# EAGLE design test nano (EAGLE 7.1.0)
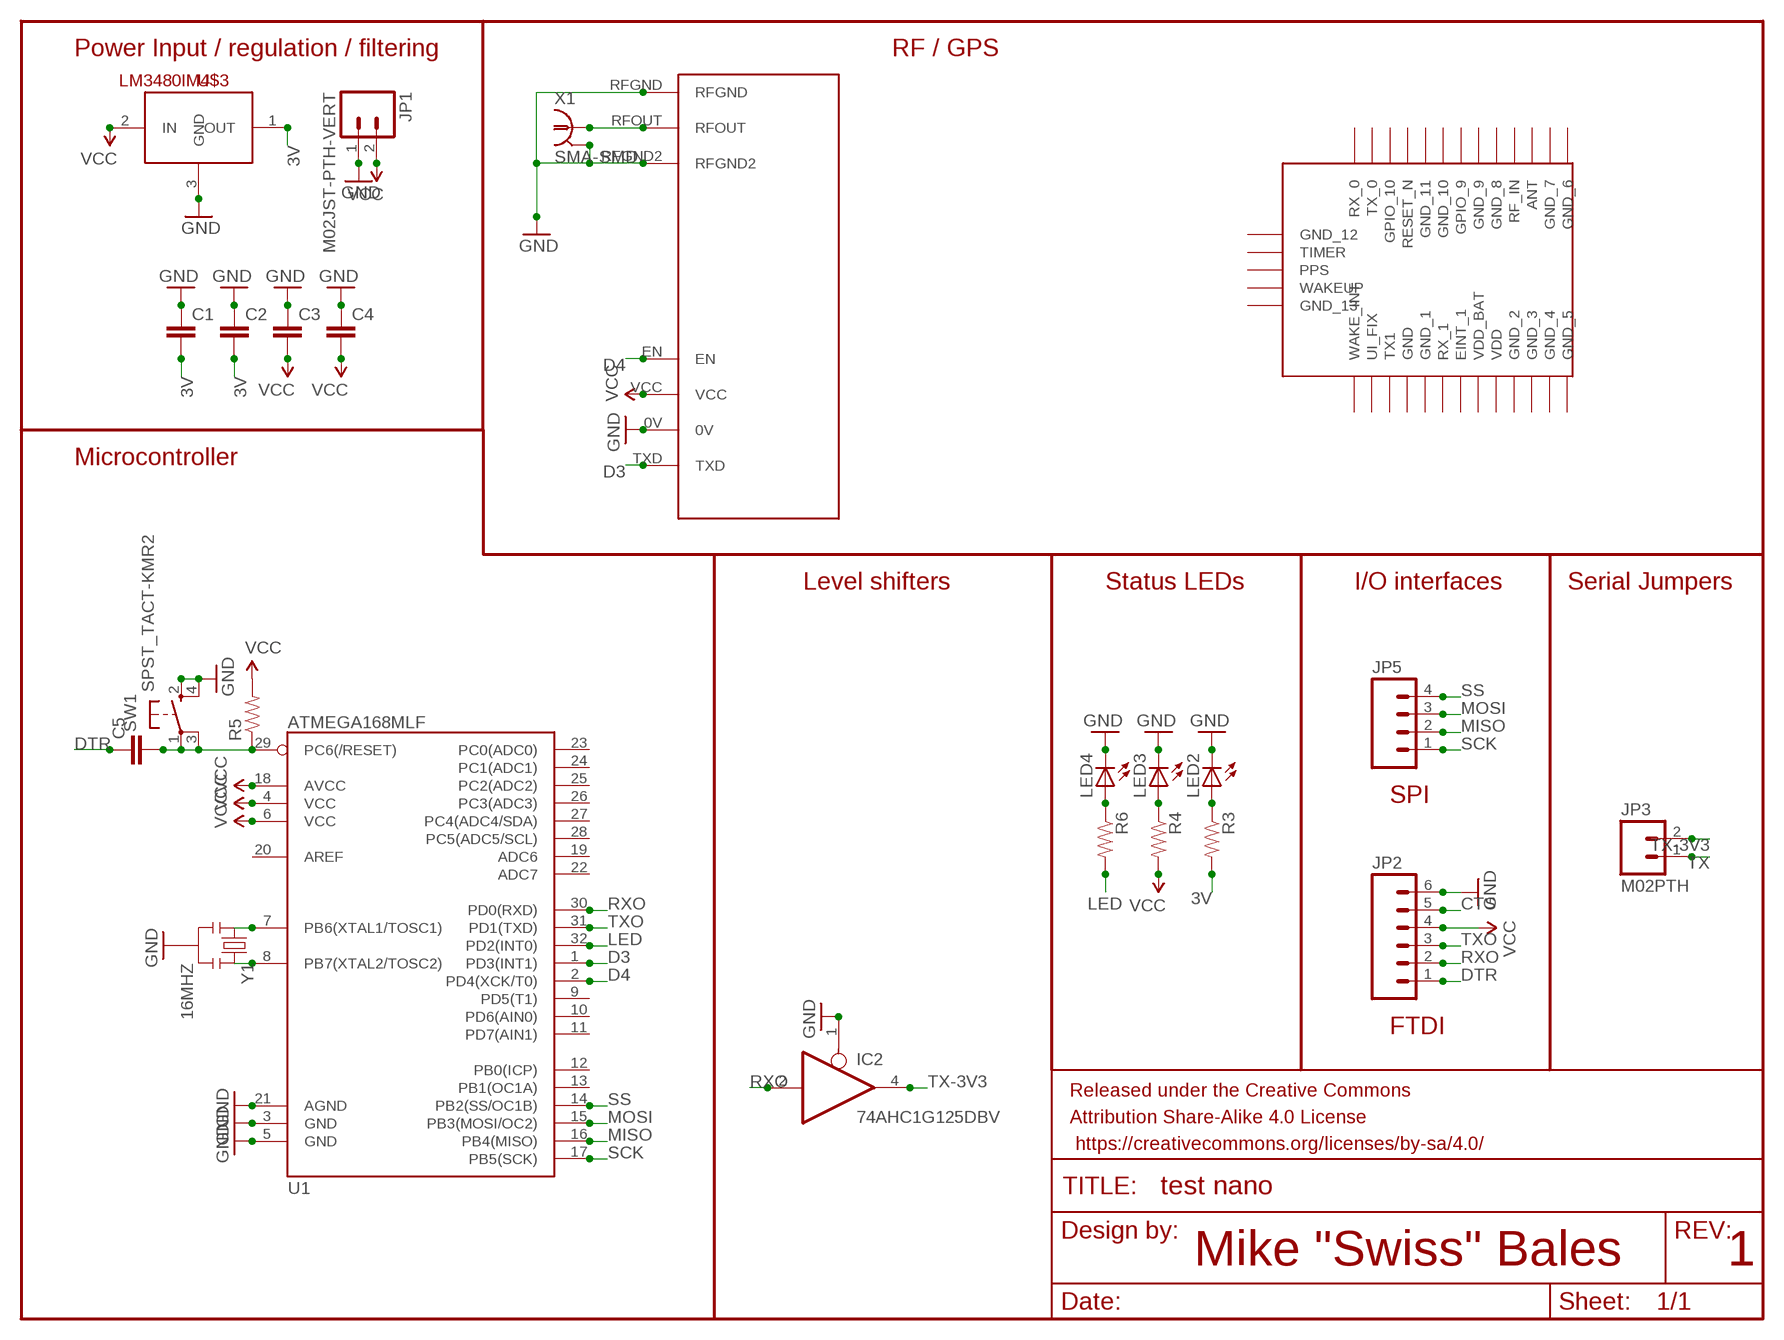
[diagram p0: schematic, sheet 1]

## Parts
C1  CAP0805  [0805]
C2  CAP0805  [0805]
C3  CAP0805  [0805]
C4  CAP0805  [0805]
C5  CAP0805  [0805]
FRAME1  FRAME-LETTER  [CREATIVE_COMMONS]
IC2  74AHC1G125DBV  [SOT23-5]
JP1  M02JST-PTH-VERT  [JST-2-PTH-VERT]
JP2  M06NO_SILK_FEMALE_PTH  [1X06_NO_SILK]
JP3  M02PTH  [1X02]
JP5  M041X04_NO_SILK  [1X04_NO_SILK]
LED2  LEDCHIP-LED0805  [CHIP-LED0805]
LED3  LEDCHIP-LED0805  [CHIP-LED0805]
LED4  LEDCHIP-LED0805  [CHIP-LED0805]
R3  RESISTOR0805-RES  [0805]
R4  RESISTOR0805-RES  [0805]
R5  RESISTOR0805-RES  [0805]
R6  RESISTOR0805-RES  [0805]
SW1  SPST_TACT-KMR2  [KMR2]
U1  ATMEGA168MLF  [MLF32]
U$1  UBLOXUC530  [UBLOXUC530]
U$2  RADIOMETRIX-HX1  [RADIOMETRIX-HX1]
U$3  LM3480IM4  [SOT23-3]
X1  SMA-SMD  [SMA-SMD]
Y1  16MHZ  RESONATOR16MHZ  [RESONATOR-SMD]

## Nets
3V: C1.2 C2.2 R3.2 U$3.1(OUT)
CTS: JP2.5
D3: U1.1(PD3(INT1)) U$2.TXD
D4: U1.2(PD4(XCK/T0)) U$2.EN
DTR: C5.1 JP2.1
GND: C1.1 C2.1 C3.1 C4.1 IC2.1(OE) JP1.1 JP2.6 LED2.C LED3.C LED4.C SW1.2(S) SW1.4(S1) U1.3(GND) U1.5(GND) U1.21(AGND) U$2.0V U$2.RFGND U$2.RFGND2 U$3.3(GND) X1.2@1 X1.2@2 X1.2@3 X1.2@4 X1.2@5 X1.2@6 Y1.2
LED: R6.2 U1.32(PD2(INT0))
MISO: JP5.2 U1.16(PB4(MISO))
MOSI: JP5.3 U1.15(PB3(MOSI/OC2))
N$1: U$2.RFOUT X1.1
N$7: LED2.A R3.1
N$8: LED3.A R4.1
N$9: C5.2 R5.1 SW1.1(P) SW1.3(P1) U1.29(PC6(/RESET))
N$14: U1.8(PB7(XTAL2/TOSC2)) Y1.3
N$26: U1.7(PB6(XTAL1/TOSC1)) Y1.1
N$27: LED4.A R6.1
RXO: IC2.2(I) JP2.2 U1.30(PD0(RXD))
SCK: JP5.1 U1.17(PB5(SCK))
SS: JP5.4 U1.14(PB2(SS/OC1B))
TX: JP3.1
TX-3V3: IC2.4(O) JP3.2
TXO: JP2.3 U1.31(PD1(TXD))
VCC: C3.2 C4.2 JP1.2 JP2.4 R4.2 R5.2 U1.4(VCC) U1.6(VCC) U1.18(AVCC) U$2.VCC U$3.2(IN)
Unconnected: U1.9(PD5(T1)) U1.10(PD6(AIN0)) U1.11(PD7(AIN1)) U1.12(PB0(ICP)) U1.13(PB1(OC1A)) U1.19(ADC6) U1.20(AREF) U1.22(ADC7) U1.23(PC0(ADC0)) U1.24(PC1(ADC1)) U1.25(PC2(ADC2)) U1.26(PC3(ADC3)) U1.27(PC4(ADC4/SDA)) U1.28(PC5(ADC5/SCL)) U$1.EINT_1 U$1.GND U$1.GND_1 U$1.GND_2 U$1.GND_3 U$1.GND_4 U$1.GND_5 U$1.GND_6 U$1.GND_7 U$1.GND_8 U$1.GND_9 U$1.GND_10 U$1.GND_11 U$1.GND_12 U$1.GND_13 U$1.GPIO_9 U$1.GPIO_10 U$1.PANT(ANT) U$1.PPS U$1.RESET_N U$1.RF_IN U$1.RX_0 U$1.RX_1 U$1.TIMER U$1.TX1 U$1.TX_0 U$1.UI_FIX U$1.VDD U$1.VDD_BAT U$1.WAKE_INT U$1.WAKEUP

## Notes on the sheet
- Power Input / regulation / filtering | RF / GPS
- Microcontroller
- Level shifters | Status LEDs | I/O interfaces | Serial Jumpers
- SPI
- FTDI
- Mike "Swiss" Bales | 1

## Power pins joined to a net without a drawn wire
GND: IC2.3(GND)
VCC: IC2.5(VCC)

## Library data of the parts
C1-C5 = SparkFun-Capacitors:CAP: Capacitor Standard 0603 ceramic capacitor, and 0.1" leaded capacitor.
FRAME1 = SparkFun-Aesthetics:FRAME-LETTER: Schematic Frame Standard 8.5x11 US Letter frame
IC2 = 74xx-little-us:74*1G125: Single Bus Buffer Gate with 3-State Output
JP1 JP3 = SparkFun-Connectors:M02: Standard 2-pin 0.1" header. Use with - straight break away headers ( PRT-00116) - right angle break away headers (PRT-00553) - swiss pins (PRT-00743) - machine pins (PRT-00117) - female headers (PRT-00115) Molex polarized connector foot print use with: PRT-08233 with associated crimp pins and housings. 2.54_SCREWTERM for use with PRT-10571. 3.5mm Screw Terminal footprints for PRT-08084 5mm Screw Terminal footprints for use with PRT-08432
JP2 = SparkFun-Connectors:M06: Header 6 Standard 6-pin 0.1" header. Use with straight break away headers (SKU : PRT-00116), right angle break away headers (PRT-00553), swiss pins (PRT-00743), machine pins (PRT-00117), and female headers (PRT-00115). Molex polarized connector foot print use with SKU : PRT-08094 with associated crimp pins and housings. NOTES ON THE VARIANTS LOCK and LOCK_LONGPADS... This footprint was designed to help hold the alignment of a through-hole component (i.e. 6-pin header) while soldering it into place. You may notice that each hole has been shifted either up or down by 0.005 of an inch from it's more standard position (which is a perfectly straight line). This slight alteration caused the pins (the squares in the middle) to touch the edges of the holes. Because they are alternating, it causes a "brace" to hold the component in place. 0.005 has proven to be the perfect amount of "off-center" position when using our standard breakaway headers. Although looks a little odd when you look at the bare footprint, once you have a header in there, the alteration is very hard to notice. Also,if you push a header all the way into place, it is covered up entirely on the bottom side. This idea of altering the position of holes to aid alignment will be further integrated into the Sparkfun Library for other footprints. It can help hold any component with 3 or more connection pins.; PROD_ID: CONN-08437
JP5 = SparkFun-Connectors:M04: Header 4 Standard 4-pin 0.1" header. Use with straight break away headers (SKU : PRT-00116), right angle break away headers (PRT-00553), swiss pins (PRT-00743), machine pins (PRT-00117), and female headers (PRT-00115). Molex polarized connector foot print use with SKU : PRT-08231 with associated crimp pins and housings. 1MM SMD Version SKU: PRT-10208
LED2-LED4 = adafruit:LED: LED OSRAM: - CHIPLED LG R971, LG N971, LY N971, LG Q971, LY Q971, LO R971, LY R971 LH N974, LH R974 LS Q976, LO Q976, LY Q976 LO Q996 - Hyper CHIPLED LW Q18S LB Q993, LB Q99A, LB R99A - SideLED LS A670, LO A670, LY A670, LG A670, LP A670 LB A673, LV A673, LT A673, LW A673 LH A674 LY A675 LS A676, LA A676, LO A676, LY A676, LW A676 LS A679, LY A679, LG A679 - Hyper Micro SIDELED® LS Y876, LA Y876, LO Y876, LY Y876 LT Y87S - SmartLED LW L88C, LW L88S LB L89C, LB L89S, LG L890 LS L89K, LO L89K, LY L89K LS L896, LA L896, LO L896, LY L896 - TOPLED LS T670, LO T670, LY T670, LG T670, LP T670 LSG T670, LSP T670, LSY T670, LOP T670, LYG T670 LG T671, LOG T671, LSG T671 LB T673, LV T673, LT T673, LW T673 LH T674 LS T676, LA T676, LO T676, LY T676, LB T676, LH T676, LSB T676, LW T676 LB T67C, LV T67C, LT T67C, LS T67K, LO T67K, LY T67K, LW E67C LS E67B, LA E67B, LO E67B, LY E67B, LB E67C, LV E67C, LT E67C LW T67C LS T679, LY T679, LG T679 LS T770, LO T770, LY T770, LG T770, LP T770 LB T773, LV T773, LT T773, LW T773 LH T774 LS E675, LA E675, LY E675, LS T675 LS T776, LA T776, LO T776, LY T776, LB T776 LHGB T686 LT T68C, LB T68C - Hyper Mini TOPLED® LB M676 - Mini TOPLED Santana® LG M470 LS M47K, LO M47K, LY M47K Source: http://www.osram.convergy.de/
R3-R6 = SparkFun-Resistors:RESISTOR: Resistor Basic schematic elements and footprints for 0603, 1206, and PTH resistors.
SW1 = adafruit:SPST_TACT: SMT 6mm switch, EVQQ2 series http://www.ladyada.net/library/eagle
U1 = SparkFun-DigitalIC:ATMEGA168: Atmel 32-pin 8-bit micro, 16k flash.
U$1 = uc530:UBLOXUC530: Ublox 530m integrated GPS receiver and chip antenna
U$2 = Ava:RADIOMETRIX-HX1
U$3 = SparkFun-PowerIC:LM3480IM4: Small package linear regulator
X1 = con-coax:SMA-SMD: SMA 50 Ohm Straight Jack Receptacle - Surface Mount www.johnsoncomponents.com Source: http://catalog.digikey.com .. 142-0711-201, 205, 202, 206.pdf; OC_FARNELL: unknown; OC_NEWARK: unknown
Y1 = SparkFun-FreqCtrl:RESONATOR: Resonator Small SMD resonator. Used, eg, on the Arduino Pro/ Pro Mini boards. 8MHz- XTAL-08895 16MHz- XTAL-08900; PROD_ID: XTAL-08900

## Board
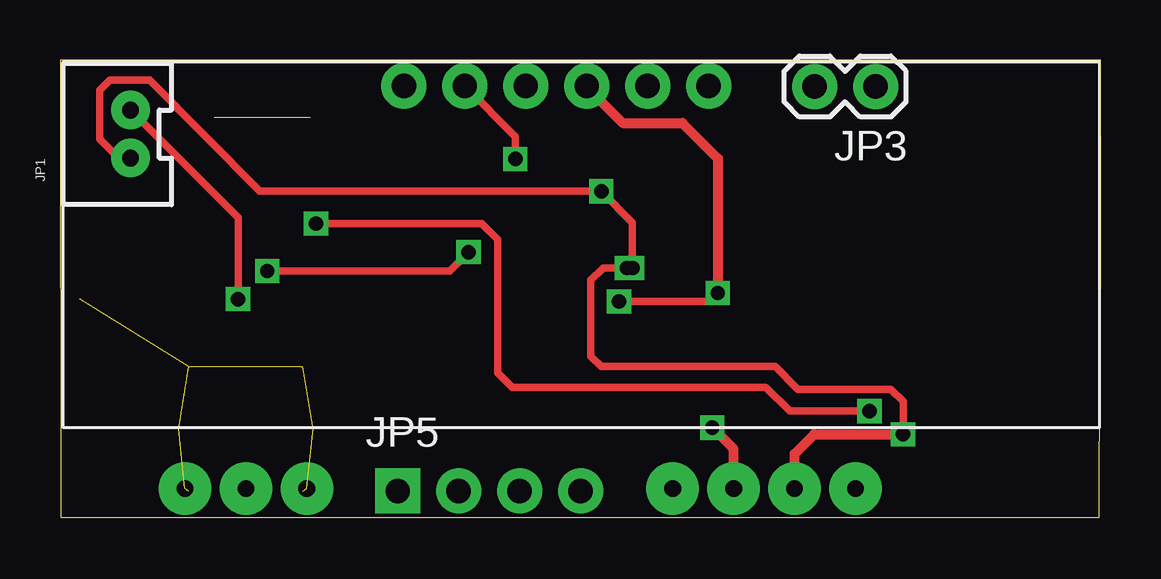
[diagram p1: board, top side]
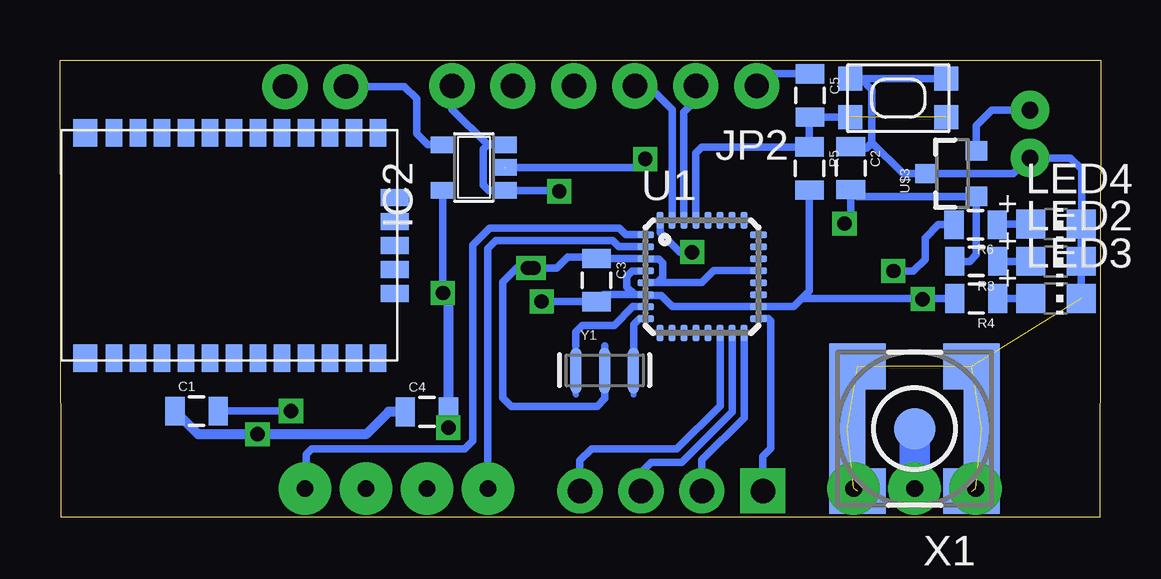
[diagram p2: board, bottom side, seen from below]

Size 43.36 x 19.07 mm. Coordinates in mm from the lower left corner, seen from the top.
Outline: 0.03,0 43.31,0 43.36,19.07 0,19.07 0.03,0
Copper layers (1*16): Top 0.035mm / dielectric 1.5mm / Bottom 0.035mm
Design rules "default": minimum track width 10mil, minimum drill 24mil, track to track 8mil, track to pad 8mil, pad to pad 8mil, via to via 8mil, smd to smd 8mil, copper to edge 40mil, drill to drill 8mil, minimum pad ring 10mil, minimum via ring 8mil, stop-mask expansion 4mil, vias tented up to drill 0mil, thermal gap 10mil

### Footprints (pad centres in the part's own frame; a part is rotated, then mirrored left to right if it is on the bottom)
0805 = smd 0.8 x 1.2: 1 -0.9,0; 2 0.9,0
SOT23-5 = smd 0.69 x 0.99: 1 -0.95,-1.29; 2 0,-1.29; 3 0.95,-1.29; 4 0.95,1.3; 5 -0.95,1.3
JST-2-PTH-VERT = drill 0.7 pad 1.6: 1 -1,-0.55; 2 1,-0.55
1X06_NO_SILK = drill 1.016 pad 1.88: 1 0,0; 2 2.54,0; 3 5.08,0; 4 7.62,0; 5 10.16,0; 6 12.7,0
1X02 = drill 1.016 pad 1.88: 1 0,0; 2 2.54,0
1X04_NO_SILK = drill 1.016 pad 1.88 square: 1 0,0 | drill 1.016 pad 1.88: 2 2.54,0; 3 5.08,0; 4 7.62,0
CHIP-LED0805 = smd 1.2 x 1.2: A 0,-1.05; C 0,1.05
KMR2 = smd 1 x 1: 1 2,0.8; 2 2,-0.8; 3 -2,0.8; 4 -2,-0.8
MLF32 = smd 0.7 x 0.3: 1 -2.35,1.75; 2 -2.35,1.25; 3 -2.35,0.75; 4 -2.35,0.25; 5 -2.35,-0.25; 6 -2.35,-0.75; 7 -2.35,-1.25; 8 -2.35,-1.75; 17 2.35,-1.75; 18 2.35,-1.25; 19 2.35,-0.75; 20 2.35,-0.25; 21 2.35,0.25; 22 2.35,0.75; 23 2.35,1.25; 24 2.35,1.75 | smd 0.3 x 0.7: 9 -1.75,-2.35; 10 -1.25,-2.35; 11 -0.75,-2.35; 12 -0.25,-2.35; 13 0.25,-2.35; 14 0.75,-2.35; 15 1.25,-2.35; 16 1.75,-2.35; 25 1.75,2.35; 26 1.25,2.35; 27 0.75,2.35; 28 0.25,2.35; 29 -0.25,2.35; 30 -0.75,2.35; 31 -1.25,2.35; 32 -1.75,2.35
UBLOXUC530 = smd 0.7 x 1.15: EINT_1 6.8,0.1; GND 3.8,0.1; GND_1 4.8,0.1; GND_2 9.8,0.1; GND_3 10.8,0.1; GND_4 11.8,0.1; GND_7 11.8,9.5; GND_8 8.8,9.5; GND_9 7.8,9.5; GND_10 5.8,9.5; GND_11 4.8,9.5; GPIO_9 6.8,9.5; GPIO_10 2.8,9.5; PANT 10.8,9.5; RESET_N 3.8,9.5; RF_IN 9.8,9.5; RX_0 0.8,9.5; RX_1 5.8,0.1; TX1 2.8,0.1; TX_0 1.8,9.5; UI_FIX 1.8,0.1; VDD 8.8,0.1; VDD_BAT 7.8,0.1; WAKE_INT 0.8,0.1 | smd 1 x 1.15: GND_5 13,0.1; GND_6 13,9.5 | smd 1.15 x 0.7: GND_12 0.1,6.8; GND_13 0.1,2.8; PPS 0.1,4.8; TIMER 0.1,5.8; WAKEUP 0.1,3.8
RADIOMETRIX-HX1 = drill 0.7 pad 2.184: 0V 8.89,-10.16; EN 3.81,-10.16; RFGND -11.43,-10.16; RFGND2 -16.51,-10.16; RFOUT -13.97,-10.16; TXD 11.43,-10.16; VCC 6.35,-10.16
SOT23-3 = smd 0.8 x 0.9: 1 -0.95,-1; 2 0.95,-1; 3 0,1.1
SMA-SMD = smd 1.73 x 1.73: 1 0,0 | smd 2.35 x 1.9: 2@1 -2.375,2.6; 2@2 -2.375,-2.6; 2@3 2.375,-2.6; 2@4 2.375,2.6 | smd 1.5 x 3.4: 2@5 -2.8,0; 2@6 2.8,0
RESONATOR-SMD = smd 0.45 x 1.905: 1 -1.2,0; 2 0,0; 3 1.2,0

### Placement (x,y rotation side)
C1  37.67,4.42 0 bottom
C2  10.41,14.55 270 bottom
C3  21,9.89 270 bottom
C4  28.07,4.39 0 bottom
C5  12.11,17.58 270 bottom
FRAME1  14.4,-8.1 0 top  (outside the outline)
IC2  26.11,14.58 90 bottom
JP1  2.39,15.98 90 top
JP2  14.33,17.98 180 bottom
JP3  33.99,17.96 180 top
JP5  14.07,1.09 0 top
LED2  1.85,10.67 270 bottom
LED3  1.85,9.12 270 bottom
LED4  1.85,12.22 270 bottom
R3  5.18,10.67 180 bottom
R4  5.18,9.12 180 bottom
R5  12.13,14.54 270 bottom
R6  5.21,12.19 180 bottom
SW1  8.43,17.48 180 bottom
U1  16.61,10.03 0 bottom
U$1  29.31,16.13 180 bottom
U$2  21.72,11.35 0 top
U$3  6.17,14.33 90 bottom
X1  7.75,3.68 180 bottom
Y1  20.66,6.11 0 bottom

### Tracks (layer width: path | path; a pad name or v marks a point on that pad's centre or on a via)
3V  (via drill 0.6)
  Top 0.305: v10.67,12.24 17.58,12.24 18.24,11.58 18.24,6.02 18.85,5.41 29.41,5.41 30.4,4.42 v33.73,4.42
  Bottom 0.305: R3.2 5.46,10.67 5.18,10.95 U$3.1 10.14,13.38 C2.2 10.41,12.5 v10.67,12.24 | v33.73,4.42 C1.2
D3
  Bottom 0.305: U1.1 19.78,11.78 20.07,12.07 25.45,12.07 26.16,11.35 26.16,3.18 26.49,2.85 32.87,2.85 33.1,2.62 33.1,1.24 U$2.TXD
D4
  Bottom 0.305: U1.2 20.07,11.28 20.32,11.53 25.2,11.53 25.53,11.2 U$2.EN
DTR
  Bottom 0.305: C5.1 13.83,18.48 JP2.1
GND  (via drill 0.6)  (8 unrouted)
  Top 0.305: JP1.1 2.44,14.98 1.65,15.76 1.65,17.81 2.08,18.21 3.73,18.21 8.33,13.59 v22.56,13.59 23.85,12.29 v23.85,10.39 | v23.62,10.39 22.63,10.39 22.12,9.88 22.12,6.71 22.56,6.27 29.79,6.27 30.73,5.33 34.62,5.33 35.13,4.83 v35.13,3.45
  Top 0.406: U$2.0V 30.61,2.64 31.42,3.45 v35.13,3.45
  Bottom 0.305: LED3.C LED2.C LED4.C 0.79,12.23 0.79,14.5 1.26,14.98 JP1.1 2.98,14.98 3.63,14.33 U$3.3 8.23,14.33 9.53,15.62 | SW1.4 SW1.2 9.97,18.28 9.53,17.83 9.53,15.62 | 9.53,15.62 9.75,15.39 10.35,15.39 C2.1 | JP2.6 27.03,17.02 25.55,15.55 24.84,15.55 IC2.3 25.54,15.53 25.73,15.34 25.73,13.84 25.5,13.61 24.84,13.61 | 24.84,13.61 IC2.1 | U1.21 16.11,10.28 16.61,9.78 U1.5 18.47,9.78 18.24,10.01 18.24,10.59 18.42,10.77 18.95,10.77 U1.3 C3.1 21.06,10.85 22.2,10.85 22.66,10.39 v23.62,10.39 v23.85,10.39 24.31,10.41 24.92,9.8 24.92,4.98 24.56,4.62 20.98,4.62 20.66,4.94 20.66,7.13 | 24.84,13.61 22.58,13.61 v22.56,13.59
  Bottom 0.406: C4.1 29.67,4.39 30.61,3.45 v35.13,3.45 37.6,3.45 C1.1
LED  (via drill 0.6)
  Top 0.305: v8.64,10.26 16.23,10.26 v17.02,11.05
  Bottom 0.305: R6.2 6.76,12.19 7.32,11.63 7.32,10.74 7.8,10.26 v8.64,10.26 | v17.02,11.05 17.53,11.05 18.34,11.86 18.34,12.36 U1.32
MISO
  Bottom 0.305: U1.16 14.86,4.14 16.61,2.39 JP5.2
MOSI
  Bottom 0.305: U1.15 15.36,4.38 17.45,2.29 18.72,2.29 19.15,1.85 JP5.3
N$1
  Bottom 1.27: U$2.RFOUT X1.1
N$7
  Bottom 0.305: LED2.A R3.1
N$8
  Bottom 0.305: LED3.A R4.1
N$9  (1 unrouted)
  Bottom 0.305: SW1.1 C5.2 12.13,16.66 R5.1 16.62,15.44 16.87,15.19 16.87,12.39 U1.29
N$14
  Bottom 0.305: U1.8 19.2,8.28 19.46,8.03 Y1.3
N$26
  Bottom 0.305: U1.7 19.49,8.78 20.27,8 21.59,8 21.87,7.72 21.87,7.14 21.86,7.13
N$27
  Bottom 0.305: LED4.A 4.28,12.22 R6.1
RXO  (via drill 0.6)
  Top 0.305: v18.97,14.94 18.97,15.88 JP2.2
  Bottom 0.305: JP2.2 16.87,17.4 17.37,16.89 17.37,12.4 U1.30 | IC2.2 19.33,14.58 v18.97,14.94
SCK
  Bottom 0.305: U1.17 13.84,8.28 13.74,8.18 13.74,2.87 14.07,2.54 JP5.1
SS
  Bottom 0.305: U1.14 15.86,4.64 17.65,2.85 21.21,2.85 21.69,2.36 JP5.4
TX-3V3
  Bottom 0.305: IC2.4 28.03,15.53 28.5,16 28.5,17.45 29.01,17.96 JP3.2
TXO
  Bottom 0.305: JP2.3 18.85,17.98 17.86,16.99 U1.31
VCC  (via drill 0.6)
  Top 0.305: v7.42,9.09 7.42,12.5 JP1.2 | v23.29,8.99 27.05,8.99 v27.41,9.35
  Top 0.406: JP2.4 21.95,17.93 23.44,16.43 25.93,16.43 27.41,14.96 v27.41,9.35 | U$2.VCC 28.07,2.85 v27.18,3.73
  Bottom 0.305: JP1.2 4.54,16.98 5.18,16.33 U$3.2 | 12.45,9.12 R4.2 7.39,9.12 v7.42,9.09 | 12.45,9.12 12.78,8.79 14.25,8.79 U1.18 17.85,8.78 18.31,9.25 18.92,9.25 U1.6 | R5.2 12.13,9.43 12.45,9.12 | U1.6 20.71,9.28 C3.2 v23.29,8.99 | U1.6 19.41,9.28 19.74,9.6 19.74,10.03 19.51,10.26 18.98,10.26 U1.4 | v27.41,9.35 IC2.5
  Bottom 0.406: v27.18,3.73 27.18,4.38 C4.2 27.17,9.11 v27.41,9.35